# EasyEDA schematic SCH_Macro Pod Lite_Easy_EDA.json
TITLE: Macro Pod Lite - https://github/com/themacroproject; REV: 1.0; Date: 2023-02-18; Sheet: 1/1; Company: The Macro Project
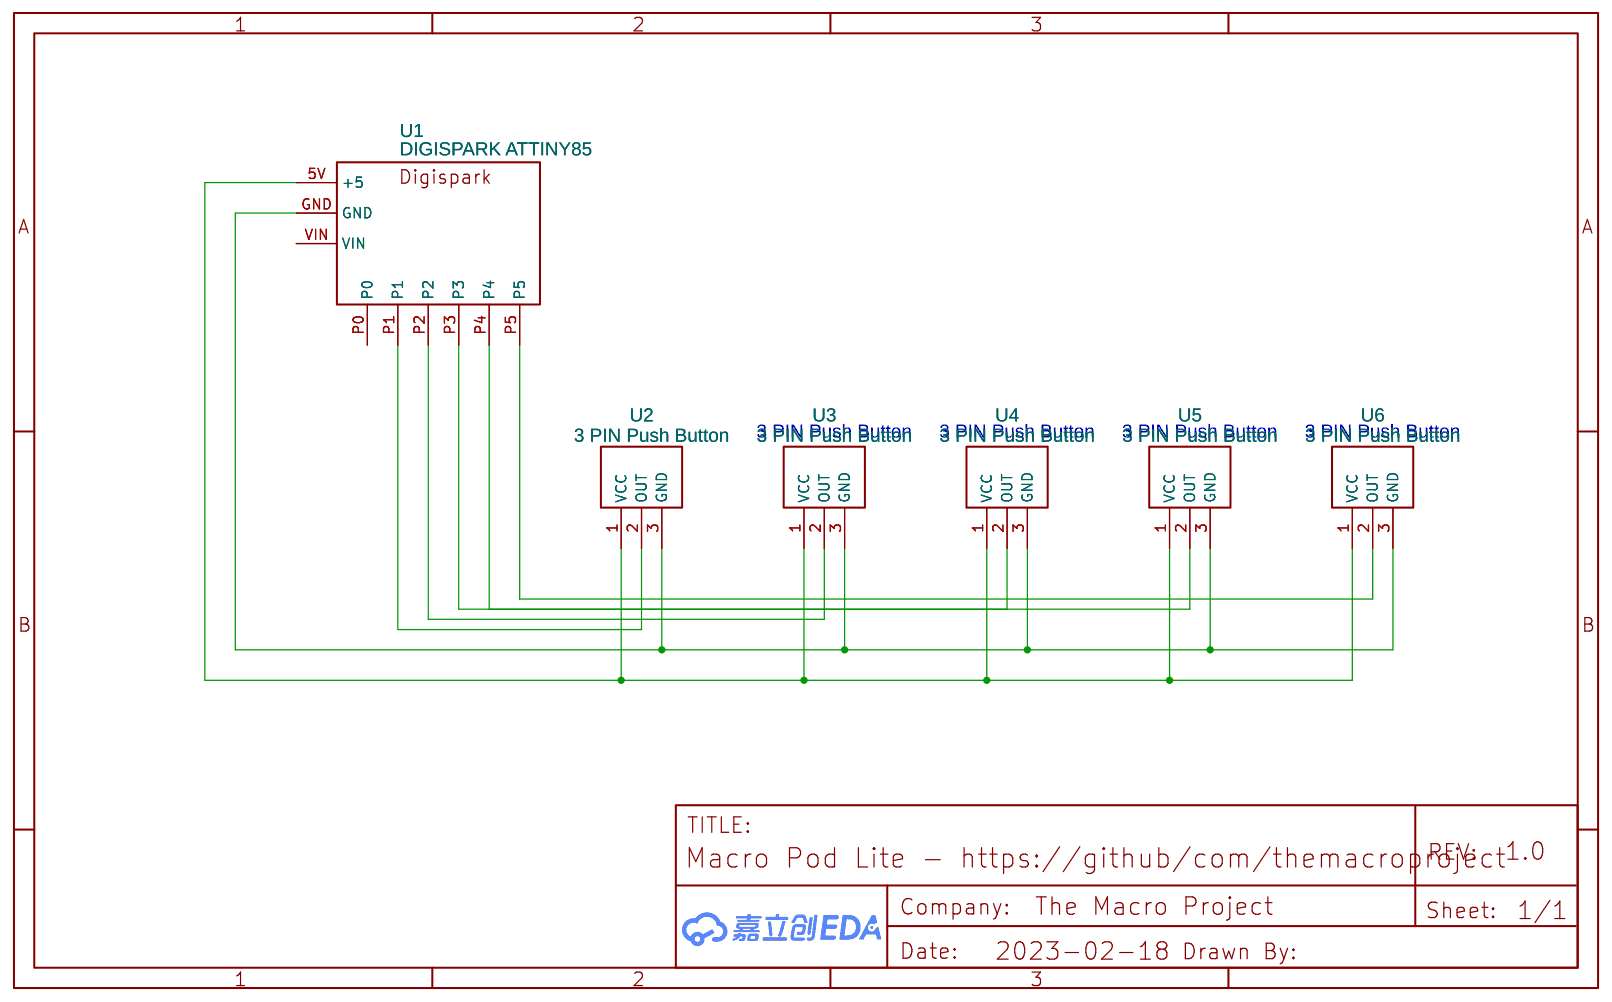
[diagram p0: schematic sheet]

## Parts
U1  DIGISPARK ATTINY85  [DIGISPARK]
U2  3 PIN Push Button  [3_PIN_PUSH BUTTON]
U3  3 PIN Push Button  [3_PIN_PUSH BUTTON]
U4  3 PIN Push Button  [3_PIN_PUSH BUTTON]
U5  3 PIN Push Button  [3_PIN_PUSH BUTTON]
U6  3 PIN Push Button  [3_PIN_PUSH BUTTON]

## Library data of the parts
U1 = DIGISPARK ATTINI85: Contributor: Danisimo; Manufacturer Part: Digispark
U2-U6 = 3 PIN Push Button copy: Contributor: MagnusInc

## Nets
Net-(U1-5V): U1.5V(+5) U2.1(VCC) U3.1(VCC) U4.1(VCC) U5.1(VCC) U6.1(VCC)
Net-(U1-GND): U1.GND U2.3(GND) U3.3(GND) U4.3(GND) U5.3(GND) U6.3(GND)
Net-(U1-P1): U1.P1 U2.2(OUT)
Net-(U1-P2): U1.P2 U3.2(OUT)
Net-(U1-P3): U1.P3 U4.2(OUT)
Net-(U1-P4): U1.P4 U5.2(OUT)
Net-(U1-P5): U1.P5 U6.2(OUT)

Not connected (* = marked no-connect by the designer): U1 P0 VIN

## Notes on the sheet
- 3 PIN Push Button
- 3 PIN Push Button
- 3 PIN Push Button
- 3 PIN Push Button
